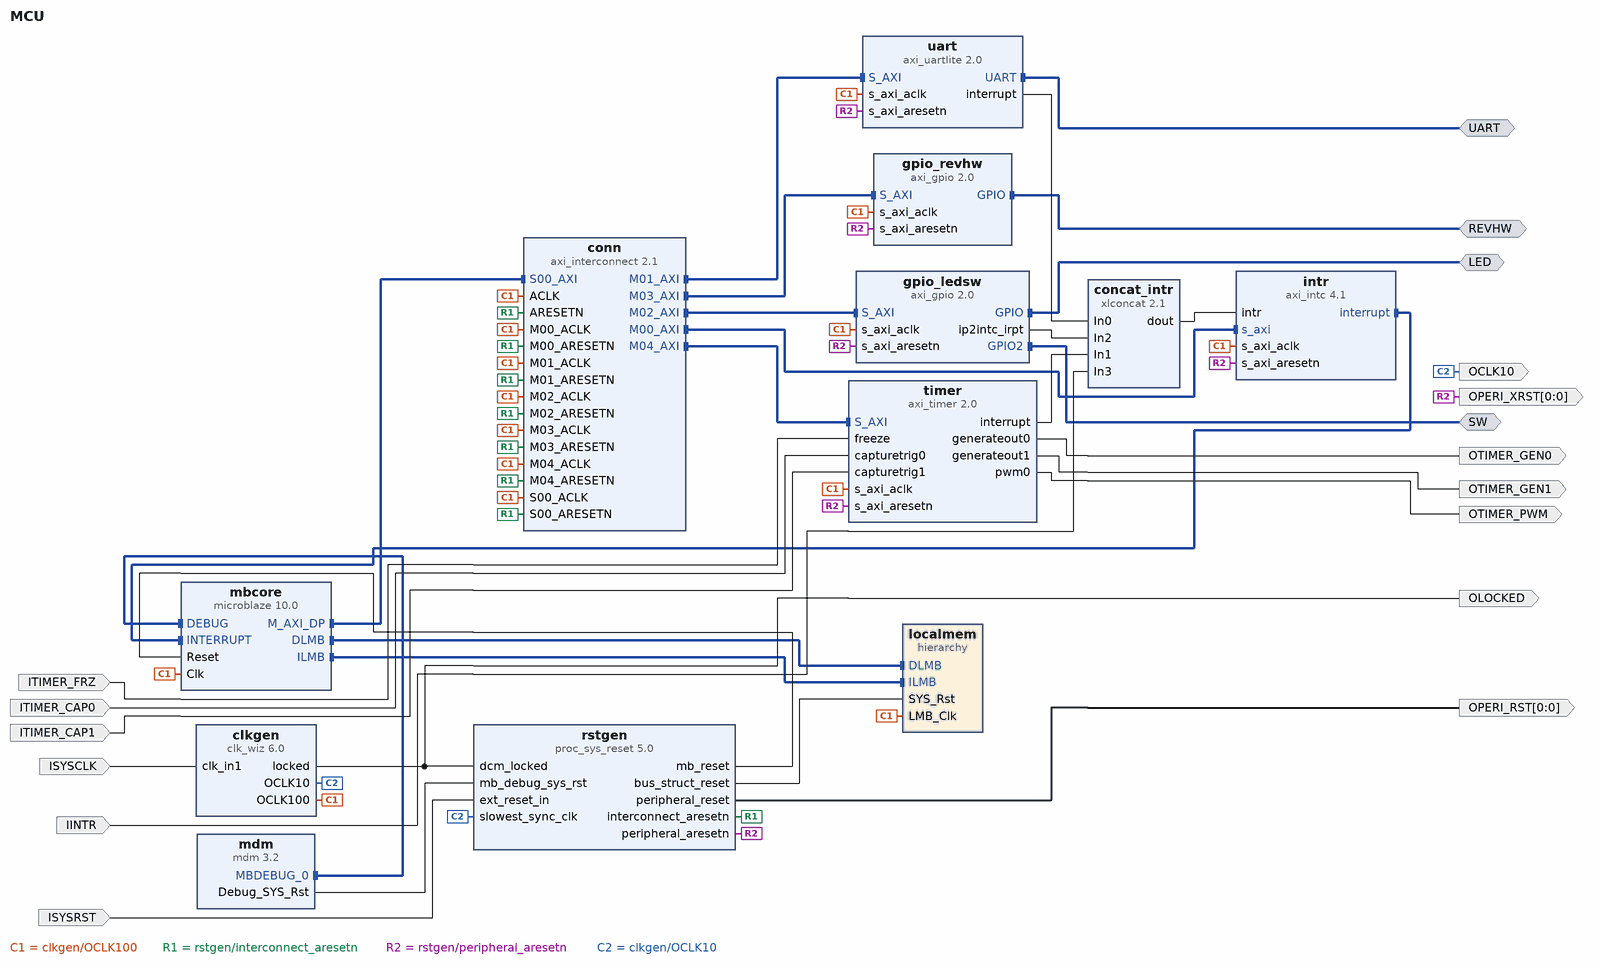
[diagram p0: block diagram of the top level]
# Vivado block design MCU, xc7a35tcpg236-1, Vivado 2018.1
create_bd_design MCU

create_bd_intf_port -mode Master -vlnv xilinx.com:interface:uart_rtl:1.0 UART
create_bd_intf_port -mode Master -vlnv xilinx.com:interface:gpio_rtl:1.0 LED
create_bd_intf_port -mode Master -vlnv xilinx.com:interface:gpio_rtl:1.0 REVHW
create_bd_intf_port -mode Master -vlnv xilinx.com:interface:gpio_rtl:1.0 SW
create_bd_port -dir O OLOCKED
create_bd_port -dir I -type clk ISYSCLK
set_property -dict {CONFIG.FREQ_HZ 12000000} [get_bd_ports ISYSCLK]
create_bd_port -dir I -type rst ISYSRST
set_property -dict {CONFIG.POLARITY ACTIVE_HIGH} [get_bd_ports ISYSRST]
create_bd_port -dir O -from 0 -to 0 OPERI_XRST
create_bd_port -dir O -type clk OCLK10
create_bd_port -dir O -from 0 -to 0 OPERI_RST
create_bd_port -dir I ITIMER_FRZ
create_bd_port -dir I ITIMER_CAP0
create_bd_port -dir I ITIMER_CAP1
create_bd_port -dir O OTIMER_GEN0
create_bd_port -dir O OTIMER_GEN1
create_bd_port -dir O OTIMER_PWM
create_bd_port -dir I IINTR

create_bd_cell -type ip -vlnv xilinx.com:ip:microblaze:10.0 mbcore
set_property -dict [list \
  CONFIG.C_AREA_OPTIMIZED 0 \
  CONFIG.C_D_AXI 1 \
  CONFIG.C_D_LMB 1 \
  CONFIG.C_I_LMB 1 \
  CONFIG.G_TEMPLATE_LIST 0 \
  CONFIG.G_USE_EXCEPTIONS 0 \
  CONFIG.C_USE_MSR_INSTR 0 \
  CONFIG.C_USE_PCMP_INSTR 0 \
  CONFIG.C_USE_BARREL 0 \
  CONFIG.C_USE_HW_MUL 0 \
  CONFIG.C_M_AXI_D_BUS_EXCEPTION 0 \
  CONFIG.C_DEBUG_ENABLED 1 \
  CONFIG.C_NUMBER_OF_PC_BRK 1 \
  CONFIG.C_USE_ICACHE 0 \
  CONFIG.C_ADDR_TAG_BITS 0 \
  CONFIG.C_USE_DCACHE 0 \
  CONFIG.C_DCACHE_ADDR_TAG 0 \
] [get_bd_cells mbcore]
create_bd_cell -type hier localmem
create_bd_cell -type ip -vlnv xilinx.com:ip:mdm:3.2 mdm
create_bd_cell -type ip -vlnv xilinx.com:ip:clk_wiz:6.0 clkgen
set_property -dict [list \
  CONFIG.PRIM_IN_FREQ 12.000 \
  CONFIG.USE_INCLK_SWITCHOVER false \
  CONFIG.SECONDARY_SOURCE Single_ended_clock_capable_pin \
  CONFIG.CLKIN1_JITTER_PS 833.33 \
  CONFIG.CLKIN2_JITTER_PS 100.0 \
  CONFIG.CLKOUT2_USED true \
  CONFIG.CLKOUT3_USED false \
  CONFIG.NUM_OUT_CLKS 2 \
  CONFIG.CLK_OUT1_PORT OCLK100 \
  CONFIG.CLK_OUT2_PORT OCLK10 \
  CONFIG.CLKOUT2_REQUESTED_OUT_FREQ 10.000 \
  CONFIG.CLKOUT3_REQUESTED_OUT_FREQ 100.000 \
  CONFIG.PRIM_SOURCE Single_ended_clock_capable_pin \
  CONFIG.FEEDBACK_SOURCE FDBK_AUTO \
  CONFIG.USE_RESET false \
  CONFIG.MMCM_DIVCLK_DIVIDE 1 \
  CONFIG.MMCM_CLKFBOUT_MULT_F 62.500 \
  CONFIG.MMCM_CLKIN1_PERIOD 83.333 \
  CONFIG.MMCM_CLKIN2_PERIOD 10.0 \
  CONFIG.MMCM_COMPENSATION ZHOLD \
  CONFIG.MMCM_CLKOUT0_DIVIDE_F 7.500 \
  CONFIG.MMCM_CLKOUT1_DIVIDE 75 \
  CONFIG.MMCM_CLKOUT2_DIVIDE 1 \
  CONFIG.CLK_IN1_BOARD_INTERFACE Custom \
  CONFIG.CLKOUT1_JITTER 479.872 \
  CONFIG.CLKOUT1_PHASE_ERROR 668.310 \
  CONFIG.CLKOUT2_JITTER 705.336 \
  CONFIG.CLKOUT2_PHASE_ERROR 668.310 \
  CONFIG.CLKOUT3_JITTER 202.114 \
  CONFIG.CLKOUT3_PHASE_ERROR 132.063 \
] [get_bd_cells clkgen]
create_bd_cell -type ip -vlnv xilinx.com:ip:proc_sys_reset:5.0 rstgen
create_bd_cell -type ip -vlnv xilinx.com:ip:axi_uartlite:2.0 uart
create_bd_cell -type ip -vlnv xilinx.com:ip:axi_interconnect:2.1 conn
set_property -dict [list \
  CONFIG.NUM_MI 5 \
  CONFIG.ENABLE_ADVANCED_OPTIONS 1 \
  CONFIG.M00_HAS_REGSLICE 3 \
  CONFIG.M01_HAS_REGSLICE 3 \
  CONFIG.M00_HAS_DATA_FIFO 1 \
  CONFIG.M01_HAS_DATA_FIFO 1 \
] [get_bd_cells conn]
create_bd_cell -type ip -vlnv xilinx.com:ip:axi_intc:4.1 intr
create_bd_cell -type ip -vlnv xilinx.com:ip:axi_gpio:2.0 gpio_ledsw
set_property -dict [list \
  CONFIG.C_GPIO_WIDTH 8 \
  CONFIG.C_GPIO2_WIDTH 8 \
  CONFIG.C_IS_DUAL 1 \
  CONFIG.C_ALL_INPUTS 0 \
  CONFIG.C_ALL_INPUTS_2 1 \
  CONFIG.C_INTERRUPT_PRESENT 1 \
  CONFIG.C_ALL_OUTPUTS 1 \
] [get_bd_cells gpio_ledsw]
create_bd_cell -type ip -vlnv xilinx.com:ip:axi_gpio:2.0 gpio_revhw
set_property -dict {CONFIG.C_ALL_INPUTS 1} [get_bd_cells gpio_revhw]
create_bd_cell -type ip -vlnv xilinx.com:ip:axi_timer:2.0 timer
set_property -dict {CONFIG.enable_timer2 1} [get_bd_cells timer]
create_bd_cell -type ip -vlnv xilinx.com:ip:xlconcat:2.1 concat_intr
set_property -dict {CONFIG.NUM_PORTS 4} [get_bd_cells concat_intr]

# ---- hierarchy /localmem ----
current_bd_instance /localmem
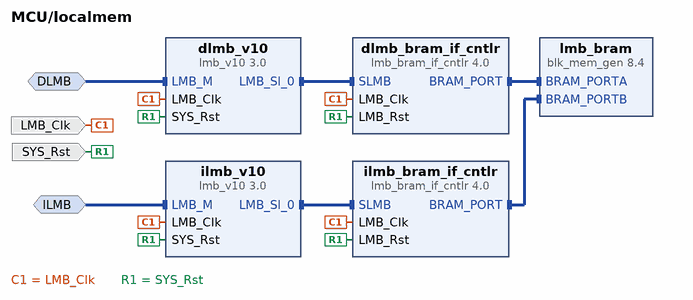
[diagram p1: block diagram inside /localmem]
create_bd_intf_pin -mode MirroredMaster -vlnv xilinx.com:interface:lmb_rtl:1.0 DLMB
create_bd_intf_pin -mode MirroredMaster -vlnv xilinx.com:interface:lmb_rtl:1.0 ILMB
create_bd_pin -dir I -type clk LMB_Clk
create_bd_pin -dir I -type rst SYS_Rst

create_bd_cell -type ip -vlnv xilinx.com:ip:lmb_v10:3.0 dlmb_v10
create_bd_cell -type ip -vlnv xilinx.com:ip:lmb_v10:3.0 ilmb_v10
create_bd_cell -type ip -vlnv xilinx.com:ip:lmb_bram_if_cntlr:4.0 dlmb_bram_if_cntlr
set_property -dict {CONFIG.C_ECC 0} [get_bd_cells dlmb_bram_if_cntlr]
create_bd_cell -type ip -vlnv xilinx.com:ip:lmb_bram_if_cntlr:4.0 ilmb_bram_if_cntlr
set_property -dict {CONFIG.C_ECC 0} [get_bd_cells ilmb_bram_if_cntlr]
create_bd_cell -type ip -vlnv xilinx.com:ip:blk_mem_gen:8.4 lmb_bram
set_property -dict {CONFIG.Memory_Type True_Dual_Port_RAM CONFIG.use_bram_block BRAM_Controller} [get_bd_cells lmb_bram]

# ---- connections ----

current_bd_instance /localmem
connect_bd_intf_net -intf_net microblaze_0_dlmb_bus [get_bd_intf_pins dlmb_v10/LMB_Sl_0] [get_bd_intf_pins dlmb_bram_if_cntlr/SLMB]
connect_bd_intf_net -intf_net microblaze_0_ilmb_bus [get_bd_intf_pins ilmb_v10/LMB_Sl_0] [get_bd_intf_pins ilmb_bram_if_cntlr/SLMB]
connect_bd_intf_net -intf_net microblaze_0_dlmb_cntlr [get_bd_intf_pins dlmb_bram_if_cntlr/BRAM_PORT] [get_bd_intf_pins lmb_bram/BRAM_PORTA]
connect_bd_intf_net -intf_net microblaze_0_ilmb_cntlr [get_bd_intf_pins ilmb_bram_if_cntlr/BRAM_PORT] [get_bd_intf_pins lmb_bram/BRAM_PORTB]
connect_bd_intf_net -intf_net microblaze_0_dlmb [get_bd_intf_pins DLMB] [get_bd_intf_pins dlmb_v10/LMB_M]
connect_bd_intf_net -intf_net microblaze_0_ilmb [get_bd_intf_pins ILMB] [get_bd_intf_pins ilmb_v10/LMB_M]
connect_bd_net -net microblaze_0_Clk [get_bd_pins LMB_Clk] \
  [get_bd_pins dlmb_v10/LMB_Clk] [get_bd_pins dlmb_bram_if_cntlr/LMB_Clk] [get_bd_pins ilmb_v10/LMB_Clk] \
  [get_bd_pins ilmb_bram_if_cntlr/LMB_Clk]
connect_bd_net [get_bd_pins SYS_Rst] \
  [get_bd_pins dlmb_v10/SYS_Rst] [get_bd_pins dlmb_bram_if_cntlr/LMB_Rst] [get_bd_pins ilmb_v10/SYS_Rst] \
  [get_bd_pins ilmb_bram_if_cntlr/LMB_Rst]

current_bd_instance /
connect_bd_intf_net -intf_net microblaze_0_dlmb_1 [get_bd_intf_pins mbcore/DLMB] [get_bd_intf_pins localmem/DLMB]
connect_bd_intf_net -intf_net microblaze_0_ilmb_1 [get_bd_intf_pins mbcore/ILMB] [get_bd_intf_pins localmem/ILMB]
connect_bd_intf_net -intf_net microblaze_0_debug [get_bd_intf_pins mdm/MBDEBUG_0] [get_bd_intf_pins mbcore/DEBUG]
connect_bd_intf_net -intf_net microblaze_M_AXI_DP [get_bd_intf_pins mbcore/M_AXI_DP] [get_bd_intf_pins conn/S00_AXI]
connect_bd_intf_net -intf_net axi_intc_0_interrupt [get_bd_intf_pins intr/interrupt] [get_bd_intf_pins mbcore/INTERRUPT]
connect_bd_intf_net -intf_net interconnect_M00_AXI [get_bd_intf_pins conn/M00_AXI] [get_bd_intf_pins intr/s_axi]
connect_bd_intf_net -intf_net interconnect_M01_AXI [get_bd_intf_pins conn/M01_AXI] [get_bd_intf_pins uart/S_AXI]
connect_bd_intf_net [get_bd_intf_pins conn/M02_AXI] [get_bd_intf_pins gpio_ledsw/S_AXI]
connect_bd_intf_net [get_bd_intf_pins conn/M03_AXI] [get_bd_intf_pins gpio_revhw/S_AXI]
connect_bd_intf_net [get_bd_intf_pins conn/M04_AXI] [get_bd_intf_pins timer/S_AXI]
connect_bd_intf_net -intf_net axi_uartlite_0_UART [get_bd_intf_ports UART] [get_bd_intf_pins uart/UART]
connect_bd_intf_net -intf_net s_LED [get_bd_intf_ports LED] [get_bd_intf_pins gpio_ledsw/GPIO]
connect_bd_intf_net -intf_net gpio_verhw_GPIO [get_bd_intf_ports REVHW] [get_bd_intf_pins gpio_revhw/GPIO]
connect_bd_intf_net [get_bd_intf_ports SW] [get_bd_intf_pins gpio_ledsw/GPIO2]
connect_bd_net -net mbcore_Clk [get_bd_pins clkgen/OCLK100] \
  [get_bd_pins mbcore/Clk] [get_bd_pins uart/s_axi_aclk] [get_bd_pins intr/s_axi_aclk] [get_bd_pins gpio_ledsw/s_axi_aclk] \
  [get_bd_pins gpio_revhw/s_axi_aclk] [get_bd_pins timer/s_axi_aclk] [get_bd_pins localmem/LMB_Clk] [get_bd_pins conn/ACLK] \
  [get_bd_pins conn/S00_ACLK] [get_bd_pins conn/M00_ACLK] [get_bd_pins conn/M01_ACLK] [get_bd_pins conn/M02_ACLK] \
  [get_bd_pins conn/M03_ACLK] [get_bd_pins conn/M04_ACLK]
connect_bd_net [get_bd_pins clkgen/locked] [get_bd_ports OLOCKED] [get_bd_pins rstgen/dcm_locked]
connect_bd_net -net mb_reset [get_bd_pins rstgen/mb_reset] [get_bd_pins mbcore/Reset]
connect_bd_net -net struct_reset [get_bd_pins rstgen/bus_struct_reset] [get_bd_pins localmem/SYS_Rst]
connect_bd_net -net mdm_1_debug_sys_rst [get_bd_pins mdm/Debug_SYS_Rst] [get_bd_pins rstgen/mb_debug_sys_rst]
connect_bd_net -net s_sysclk [get_bd_ports ISYSCLK] [get_bd_pins clkgen/clk_in1]
connect_bd_net -net reset_0_1 [get_bd_ports ISYSRST] [get_bd_pins rstgen/ext_reset_in]
connect_bd_net -net interconnect_aresetn [get_bd_pins rstgen/interconnect_aresetn] \
  [get_bd_pins conn/ARESETN] [get_bd_pins conn/S00_ARESETN] [get_bd_pins conn/M00_ARESETN] [get_bd_pins conn/M01_ARESETN] \
  [get_bd_pins conn/M02_ARESETN] [get_bd_pins conn/M03_ARESETN] [get_bd_pins conn/M04_ARESETN]
connect_bd_net -net peripheral_aresetn [get_bd_pins rstgen/peripheral_aresetn] \
  [get_bd_ports OPERI_XRST] [get_bd_pins uart/s_axi_aresetn] [get_bd_pins intr/s_axi_aresetn] \
  [get_bd_pins gpio_ledsw/s_axi_aresetn] [get_bd_pins gpio_revhw/s_axi_aresetn] [get_bd_pins timer/s_axi_aresetn]
connect_bd_net [get_bd_pins clkgen/OCLK10] [get_bd_ports OCLK10] [get_bd_pins rstgen/slowest_sync_clk]
connect_bd_net [get_bd_pins rstgen/peripheral_reset] [get_bd_ports OPERI_RST]
connect_bd_net [get_bd_pins concat_intr/dout] [get_bd_pins intr/intr]
connect_bd_net [get_bd_pins uart/interrupt] [get_bd_pins concat_intr/In0]
connect_bd_net [get_bd_pins timer/interrupt] [get_bd_pins concat_intr/In1]
connect_bd_net -net freeze_0_1 [get_bd_ports ITIMER_FRZ] [get_bd_pins timer/freeze]
connect_bd_net -net capturetrig0_0_1 [get_bd_ports ITIMER_CAP0] [get_bd_pins timer/capturetrig0]
connect_bd_net -net capturetrig1_0_1 [get_bd_ports ITIMER_CAP1] [get_bd_pins timer/capturetrig1]
connect_bd_net [get_bd_pins timer/generateout0] [get_bd_ports OTIMER_GEN0]
connect_bd_net [get_bd_pins timer/generateout1] [get_bd_ports OTIMER_GEN1]
connect_bd_net [get_bd_pins timer/pwm0] [get_bd_ports OTIMER_PWM]
connect_bd_net [get_bd_pins gpio_ledsw/ip2intc_irpt] [get_bd_pins concat_intr/In2]
connect_bd_net [get_bd_ports IINTR] [get_bd_pins concat_intr/In3]

# ---- address map ----
assign_bd_address -offset 0x00000000 -range 32K -target_address_space [get_bd_addr_spaces mbcore/Data] [get_bd_addr_segs localmem/dlmb_bram_if_cntlr/SLMB/Mem]
assign_bd_address -offset 0x01000000 -range 64K -target_address_space [get_bd_addr_spaces mbcore/Data] [get_bd_addr_segs intr/S_AXI/Reg]
assign_bd_address -offset 0x02000000 -range 64K -target_address_space [get_bd_addr_spaces mbcore/Data] [get_bd_addr_segs uart/S_AXI/Reg]
assign_bd_address -offset 0x03000000 -range 64K -target_address_space [get_bd_addr_spaces mbcore/Data] [get_bd_addr_segs gpio_ledsw/S_AXI/Reg]
assign_bd_address -offset 0x04000000 -range 64K -target_address_space [get_bd_addr_spaces mbcore/Data] [get_bd_addr_segs gpio_revhw/S_AXI/Reg]
assign_bd_address -offset 0x05000000 -range 64K -target_address_space [get_bd_addr_spaces mbcore/Data] [get_bd_addr_segs timer/S_AXI/Reg]
assign_bd_address -offset 0x00000000 -range 32K -target_address_space [get_bd_addr_spaces mbcore/Instruction] [get_bd_addr_segs localmem/ilmb_bram_if_cntlr/SLMB/Mem]

validate_bd_design
save_bd_design
